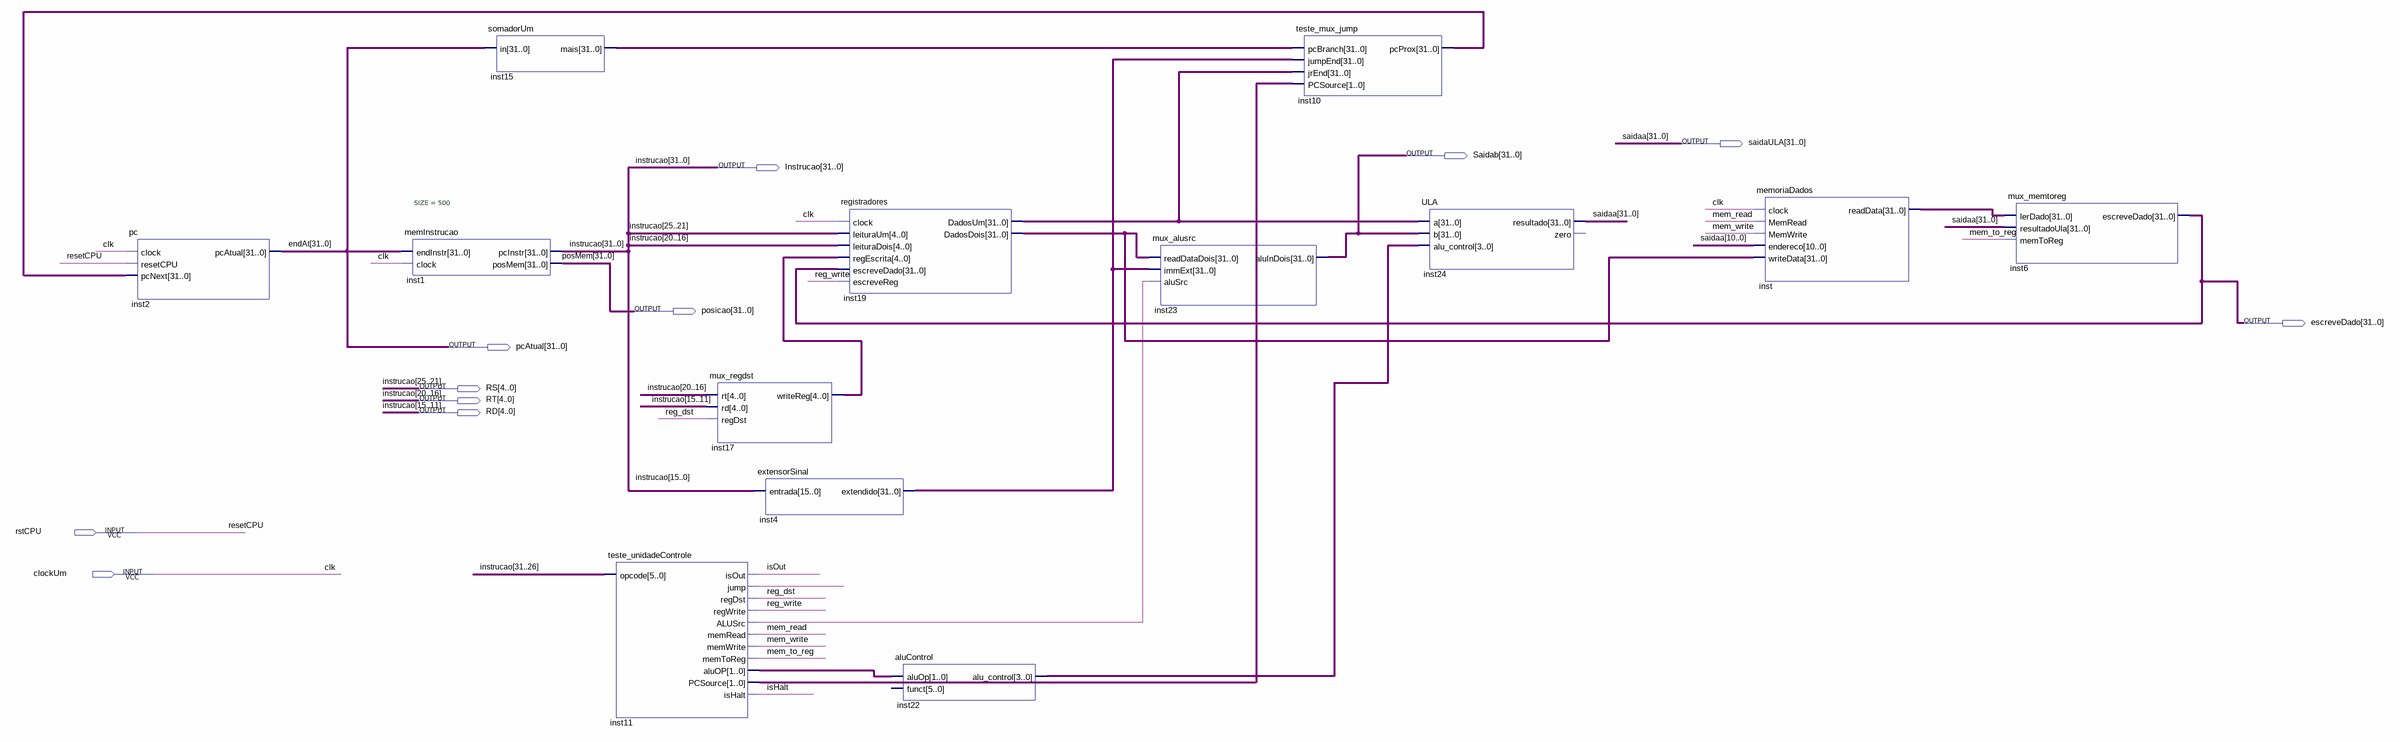
[diagram p0: schematic sheet]
// Quartus schematic teste.bdf as structural Verilog: 13 symbols, 11 pins
module teste (
  input  rstCPU,
  input  clockUm,
  output [31:0] saidaULA,
  output [31:0] Saidab,
  output [31:0] Instrucao,
  output [31:0] posicao,
  output [31:0] escreveDado,
  output [31:0] pcAtual,
  output [4:0] RS,
  output [4:0] RT,
  output [4:0] RD
);

  wire inst11_alusrc, inst11_jump, isHalt, isOut, mem_read, mem_to_reg, mem_write, reg_dst, reg_write;
  wire [1:0] inst11_aluop, inst11_pcsource;
  wire [3:0] inst22_alu_control;
  wire [4:0] inst17_writereg;
  wire [31:0] inst4_extendido, inst10_pcprox, inst15_mais, inst19_dadosdois, inst19_dadosum, inst_readdata;

  pc inst2 (.clock(clockUm), .resetCPU(rstCPU), .pcNext(inst10_pcprox), .pcAtual(pcAtual));
  memInstrucao #(.SIZE(500)) inst1 (.endInstr(pcAtual), .clock(clockUm), .pcInstr(Instrucao), .posMem(posicao));
  somadorUm inst15 (.in(pcAtual), .mais(inst15_mais));
  teste_unidadeControle inst11 (
    .opcode(Instrucao[31:26]), .isOut(isOut), .jump(inst11_jump), .regDst(reg_dst), .regWrite(reg_write),
    .ALUSrc(inst11_alusrc), .memRead(mem_read), .memWrite(mem_write), .memToReg(mem_to_reg),
    .aluOP(inst11_aluop), .PCSource(inst11_pcsource), .isHalt(isHalt));
  mux_regdst inst17 (.rt(Instrucao[20:16]), .rd(Instrucao[15:11]), .regDst(reg_dst), .writeReg(inst17_writereg));
  extensorSinal inst4 (.entrada(Instrucao[15:0]), .extendido(inst4_extendido));
  registradores inst19 (
    .clock(clockUm), .leituraUm(Instrucao[25:21]), .leituraDois(Instrucao[20:16]),
    .regEscrita(inst17_writereg), .escreveDado(escreveDado), .escreveReg(reg_write),
    .DadosUm(inst19_dadosum), .DadosDois(inst19_dadosdois));
  aluControl inst22 (.aluOp(inst11_aluop), .alu_control(inst22_alu_control));  // open: funct
  mux_alusrc inst23 (
    .readDataDois(inst19_dadosdois), .immExt(inst4_extendido), .aluSrc(inst11_alusrc), .aluInDois(Saidab));
  teste_mux_jump inst10 (
    .pcBranch(inst15_mais), .jumpEnd(inst4_extendido), .jrEnd(inst19_dadosum), .PCSource(inst11_pcsource),
    .pcProx(inst10_pcprox));
  ULA inst24 (.a(inst19_dadosum), .b(Saidab), .alu_control(inst22_alu_control), .resultado(saidaULA));  // open: zero
  memoriaDados inst (
    .clock(clockUm), .MemRead(mem_read), .MemWrite(mem_write), .endereco(saidaULA[10:0]),
    .writeData(inst19_dadosdois), .readData(inst_readdata));
  mux_memtoreg inst6 (
    .lerDado(inst_readdata), .resultadoUla(saidaULA), .memToReg(mem_to_reg), .escreveDado(escreveDado));

  assign RD = Instrucao[15:11];
  assign RS = Instrucao[25:21];
  assign RT = Instrucao[20:16];

  // Other names for the same wires on the sheet: clk = clockUm; endAt[31:0] = pcAtual; posMem[31:0] = posicao;
  //   resetCPU = rstCPU; saidaa[31:0] = saidaULA
endmodule
